# Altium schematic sheet Main.SchDoc
size A4
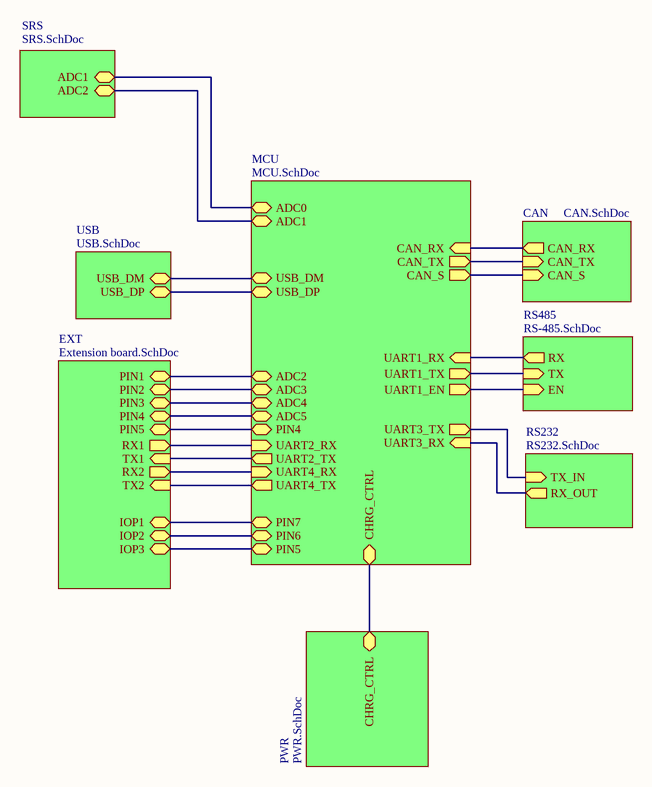
[diagram p0: Main.SchDoc]

## Sub-sheets
CAN = CAN.SchDoc: CAN_TX (in), CAN_RX (out), CAN_S (in)
EXT = Extension board.SchDoc: PIN1, PIN2, PIN3, PIN4, RX1 (out), TX1 (in), RX2 (out), TX2 (in), IOP1, IOP2, IOP3, PIN5
MCU = MCU.SchDoc: CAN_RX (in), CAN_TX (out), CAN_S (out), USB_DM (bidir), USB_DP (bidir), ADC0, ADC1, ADC2, ADC3, ADC4, ADC5, UART3_TX (out), UART3_RX (in), UART1_RX (in), UART1_TX (out), UART1_EN (out), UART2_RX (in), UART2_TX (out), UART4_RX (in), UART4_TX (out), PIN7, PIN6, CHRG_CTRL, PIN5, PIN4
PWR = PWR.SchDoc: CHRG_CTRL
RS232 = RS232.SchDoc: TX_IN (in), RX_OUT (out)
RS485 = RS-485.SchDoc: RX (out), TX (in), EN (in)
SRS = SRS.SchDoc: ADC1, ADC2
USB = USB.SchDoc: USB_DM (bidir), USB_DP (bidir)

## Nets
(unnamed): sheet SRS/ADC1, sheet MCU/ADC0
(unnamed): sheet SRS/ADC2, sheet MCU/ADC1
(unnamed): sheet MCU/CAN_RX, sheet CAN/CAN_RX
(unnamed): sheet MCU/CAN_TX, sheet CAN/CAN_TX
(unnamed): sheet MCU/CAN_S, sheet CAN/CAN_S
(unnamed): sheet MCU/USB_DM, sheet USB/USB_DM
(unnamed): sheet MCU/USB_DP, sheet USB/USB_DP
(unnamed): sheet MCU/ADC2, sheet EXT/PIN1
(unnamed): sheet MCU/ADC3, sheet EXT/PIN2
(unnamed): sheet MCU/ADC4, sheet EXT/PIN3
(unnamed): sheet MCU/ADC5, sheet EXT/PIN4
(unnamed): sheet MCU/UART3_TX, sheet RS232/TX_IN
(unnamed): sheet MCU/UART3_RX, sheet RS232/RX_OUT
(unnamed): sheet MCU/UART1_RX, sheet RS485/RX
(unnamed): sheet MCU/UART1_TX, sheet RS485/TX
(unnamed): sheet MCU/UART1_EN, sheet RS485/EN
(unnamed): sheet MCU/UART2_RX, sheet EXT/RX1
(unnamed): sheet MCU/UART2_TX, sheet EXT/TX1
(unnamed): sheet MCU/UART4_RX, sheet EXT/RX2
(unnamed): sheet MCU/UART4_TX, sheet EXT/TX2
(unnamed): sheet MCU/PIN7, sheet EXT/IOP1
(unnamed): sheet MCU/PIN6, sheet EXT/IOP2
(unnamed): sheet MCU/CHRG_CTRL, sheet PWR/CHRG_CTRL
(unnamed): sheet MCU/PIN5, sheet EXT/IOP3
(unnamed): sheet MCU/PIN4, sheet EXT/PIN5